# EasyEDA Pro project demo.eprj

# Schematic Schematic1
Create Date: 2024-03-22; Page Name: P1; Project Name: demo; Schematic Name: Schematic1; Update Date: 2024-03-23; Company: 嘉立创EDA; Page Size: A4; Version: V1.0
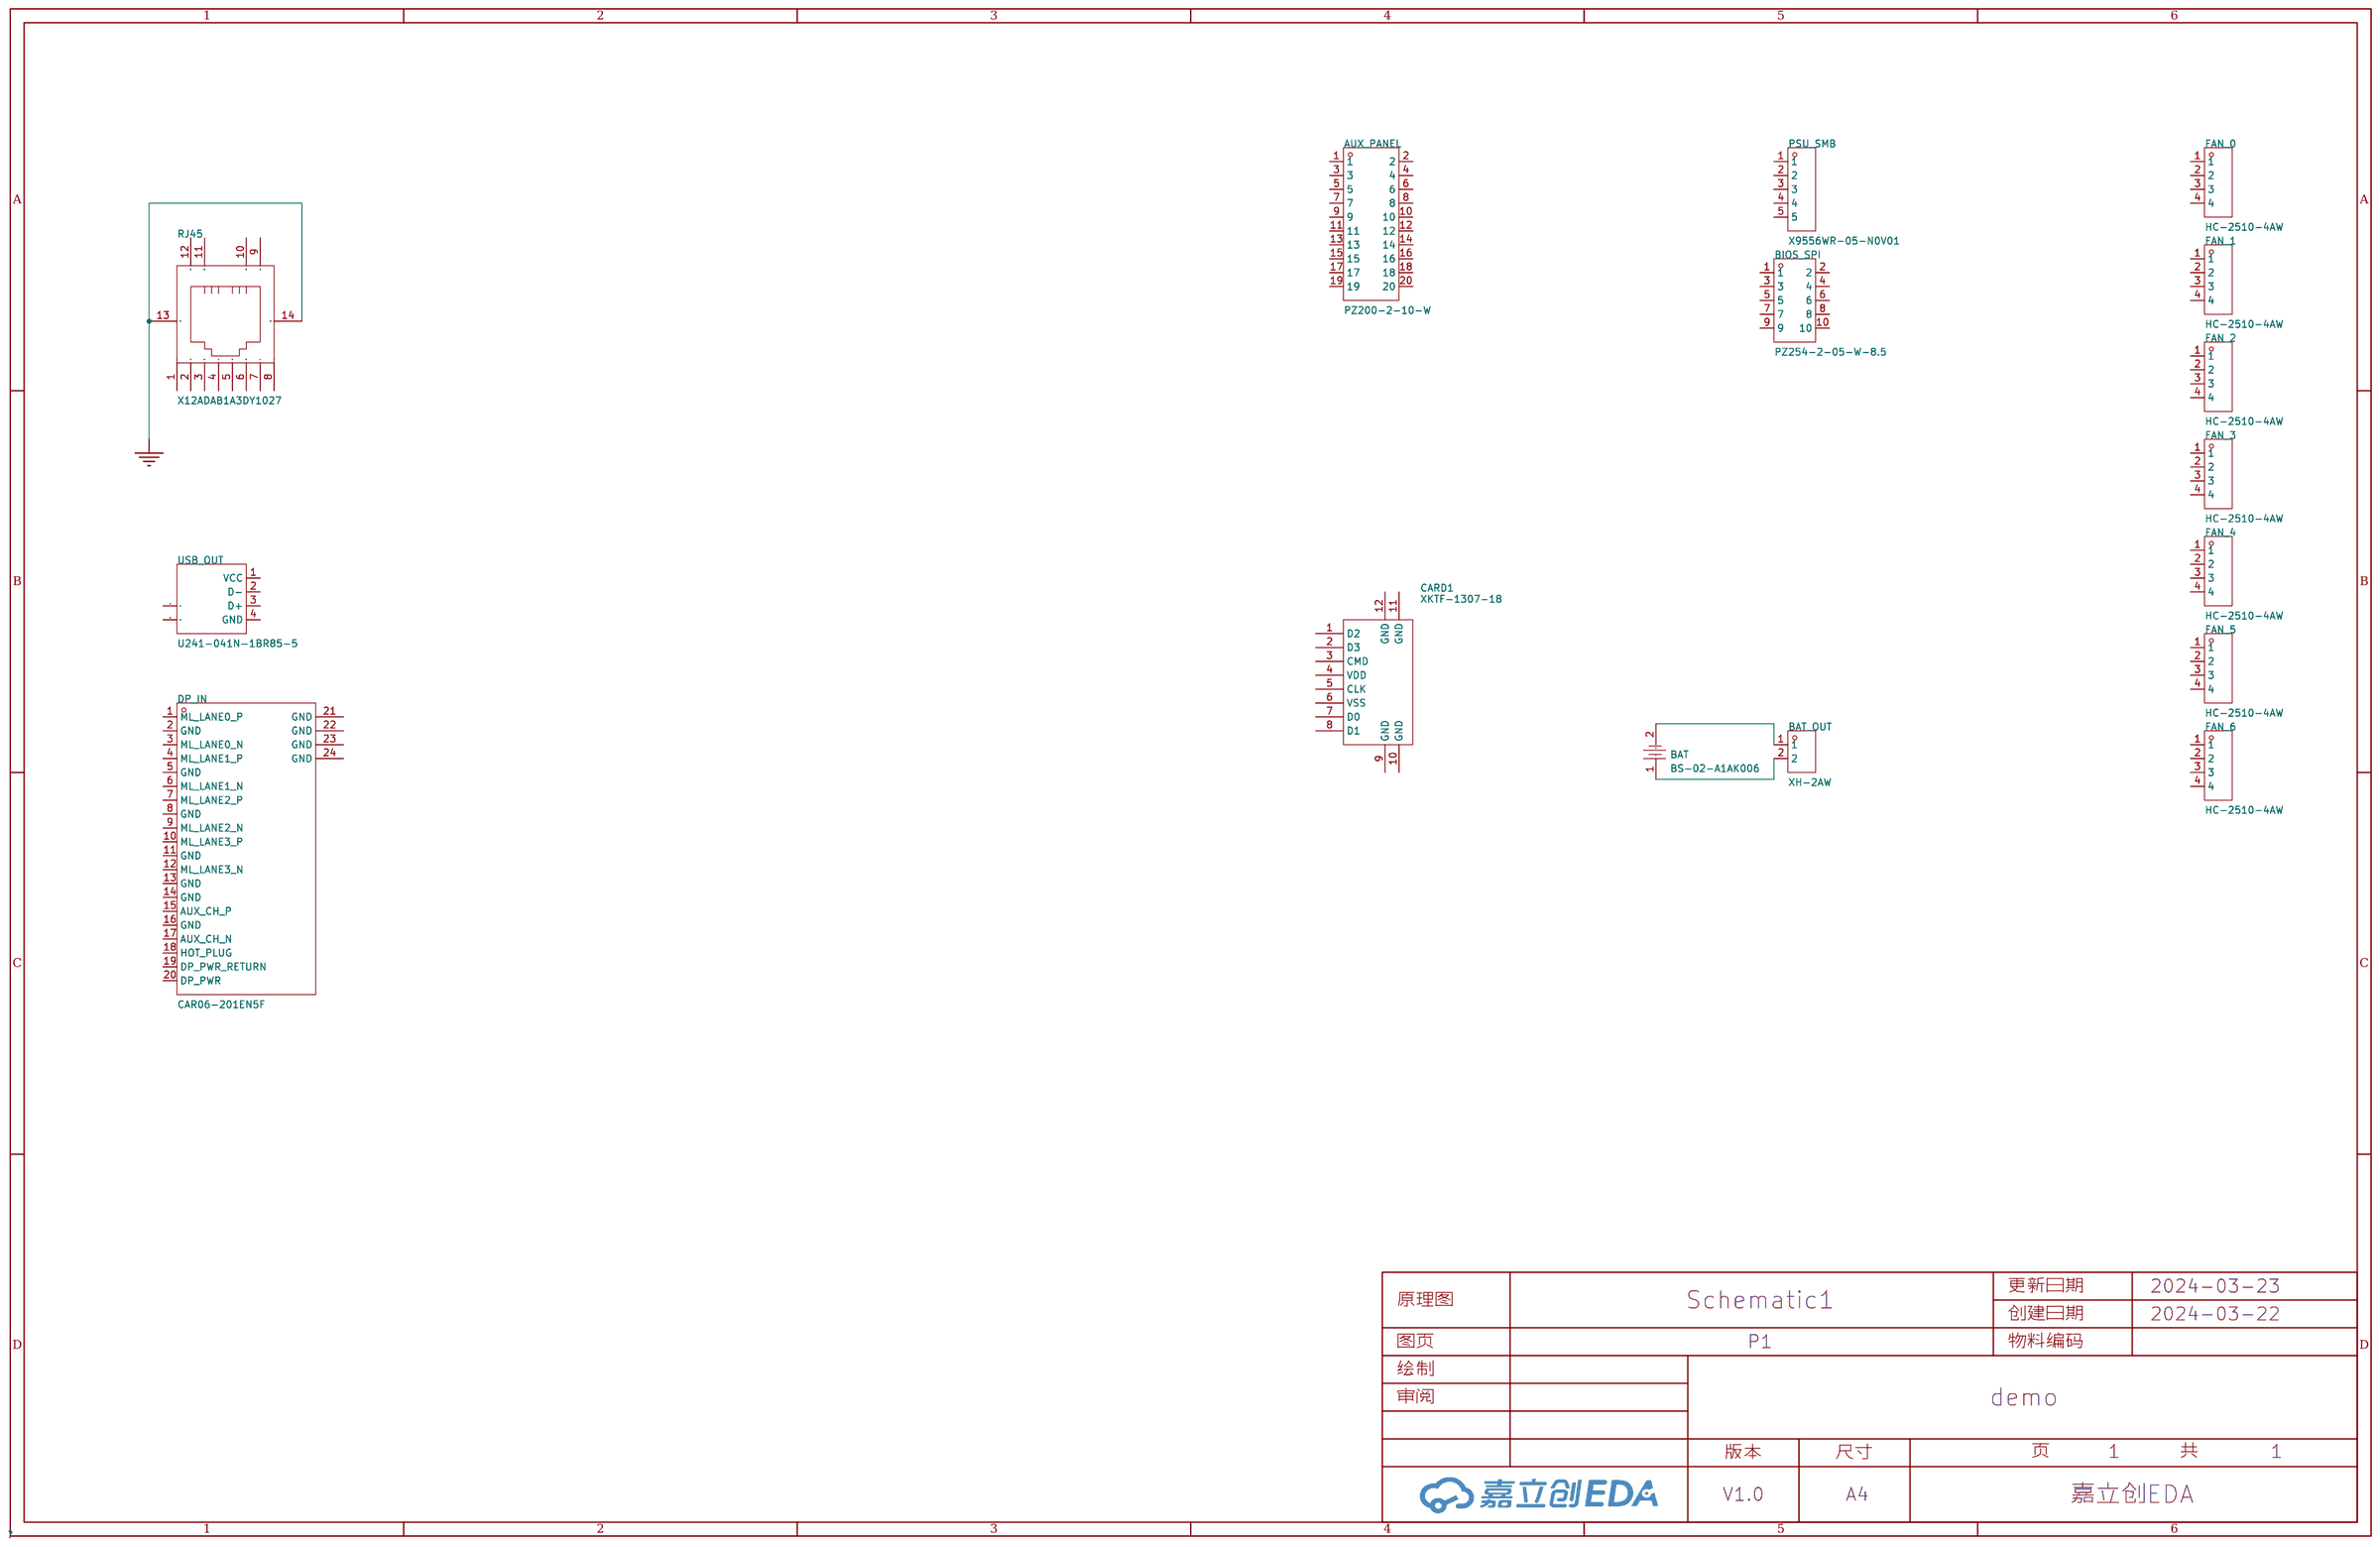
[diagram p0: schematic sheet]

## Parts
AUX_PANEL  PZ200-2-10-W  [HDR-TH_20P-P2.00-H-M-R2-C10-S2.00-W9.4]
BAT  BS-02-A1AK006  [BAT-TH_BS-02-A1AK006]
BAT_OUT  XH-2AW  [CONN-TH_XH-2AW_C2908611]
BIOS_SPI  PZ254-2-05-W-8.5  [HDR-TH_10P-P2.54-H-M-R2-C5-S2.54-N]
CARD1  XKTF-1307-18  [TF-SMD_XKTF-1307-18]
DP_IN  CAR06-201EN5F  [DP-SMD_CAR06-201EN5F]
FAN_0  HC-2510-4AW  [CONN-TH_4P-P2.54_HCTL_HC-2510-4AW]
FAN_1  HC-2510-4AW  [CONN-TH_4P-P2.54_HCTL_HC-2510-4AW]
FAN_2  HC-2510-4AW  [CONN-TH_4P-P2.54_HCTL_HC-2510-4AW]
FAN_3  HC-2510-4AW  [CONN-TH_4P-P2.54_HCTL_HC-2510-4AW]
FAN_4  HC-2510-4AW  [CONN-TH_4P-P2.54_HCTL_HC-2510-4AW]
FAN_5  HC-2510-4AW  [CONN-TH_4P-P2.54_HCTL_HC-2510-4AW]
FAN_6  HC-2510-4AW  [CONN-TH_4P-P2.54_HCTL_HC-2510-4AW]
PSU_SMB  X9556WR-05-N0V01  [CONN-TH_5P-P2.54_X9556WR-05-N0V01]
RJ45  X12ADAB1A3DY1027  [RJ45-TH_XKB_X12ADAB1A3DY1027]
USB_OUT  U241-041N-1BR85-5  [USB-B-TH_U241-041N-1BR85-1]

## Library data of the parts
AUX_PANEL = PZ200-2-10-W: 插针结构:2x10P;间距:2mm;行距:2mm;圆针/方针:方针;安装类型:弯插;排数:双排;总PIN位数:20P;额定电流:1.5A;额定电压:-;配合针长度:4mm;塑高:2mm;端接针长度:-;触头材质:黄铜;工作温度范围:-40℃~+105℃;焊接温度(最大值):260℃@5S;颜色:黑色;; LCSC Part Name: 2x10P 间距:2mm 方针 弯插; Supplier Part: C2906016; Manufacturer: HCTL(华灿天禄); Supplier Footprint: 弯插,P=2mm; JLCPCB Part Class: 扩展库; Datasheet: https://atta.szlcsc.com/upload/public/pdf/source/20230609/C576DAC8165D5B0B9EF6C372F4465F85.pdf; Supplier: LCSC; Pin Structure: 2x10P; Pitch: 2mm; Row Spacing: 2mm; Circluar Pins/Square Pins: 方针; Mounting Type: 弯插; Number of Rows: 双排; Number of Pins: 20P; Current Rating (Max): 1.5A; Length of Mating Pin: 4mm; Insulation Height: 2mm; Contact Material: 黄铜; Operating Temperature Range: -40℃~+105℃; Soldering Temperature(Max): 260℃@5S; Color: 黑色
BAT = BS-02-A1AK006: 连接器类型:电池底座;适用电池规格:CR2032;触点电镀:锡;工作温度范围:-25℃~+85℃;; LCSC Part Name: 电池底座 适用电池:CR2032; Supplier Part: C964746; Manufacturer: MYOUNG(美阳); Supplier Footprint: 插件; JLCPCB Part Class: 扩展库; Datasheet: https://atta.szlcsc.com/upload/public/pdf/source/20201218/C964746_D636BD2F273EEE7B636B6EF7E90F8FC5.pdf; Supplier: LCSC; Connector Type: 电池底座; Battery Type: CR2032; Contact Plating: 锡; Operating Temperature Range: -25℃~+85℃
BAT_OUT = XH-2AW_C2908611: 插针结构:1x2P;间距:2.54mm;安装方式:弯插;参考系列:XH;总PIN数:2P;排数:1;每排PIN数:2;行距:-;额定电流:3A;触头材质:黄铜;触头镀层:锡;工作温度范围:-25℃~+85℃;; LCSC Part Name: 1x2P 间距:2.54mm 弯插 系列:XH; Supplier Part: C2908611; Manufacturer: HCTL(华灿天禄); Supplier Footprint: 弯插,P=2.54mm; JLCPCB Part Class: 扩展库; Datasheet: https://atta.szlcsc.com/upload/public/pdf/source/20230711/B565BAF3B11666EF6B81B3605408F2BD.pdf; Supplier: LCSC; Pins Structure: 1x2P; Pitch: 2.54mm; Mounting Style: 弯插; Reference Series: XH; Number of Pins: 2P; Number of Rows: 1; Number of PINs Per Row: 2; Current Rating (Max): 3A; Contact Material: 黄铜; Contact Plating: 锡; Operating Temperature Range: -25℃~+85℃
BIOS_SPI = PZ254-2-05-W-8.5: 插针结构:2x5P;间距:2.54mm;行距:2.54mm;圆针/方针:方针;安装类型:弯插;排数:双排;总PIN位数:10P;额定电流:3A;额定电压:-;配合针长度:6mm;塑高:2.5mm;端接针长度:-;触头材质:-;工作温度范围:-40℃~+105℃;焊接温度(最大值):260℃@10S;颜色:黑色;; LCSC Part Name: 2x5P 间距:2.54mm 方针 弯插; Supplier Part: C2894985; Manufacturer: HCTL(华灿天禄); Supplier Footprint: 弯插,P=2.54mm; JLCPCB Part Class: 扩展库; Datasheet: https://atta.szlcsc.com/upload/public/pdf/source/20230609/1B60364E488FD8696AA7206A46578DEA.pdf; Supplier: LCSC; Pin Structure: 2x5P; Pitch: 2.54mm; Row Spacing: 2.54mm; Circluar Pins/Square Pins: 方针; Mounting Type: 弯插; Number of Rows: 双排; Number of Pins: 10P; Current Rating (Max): 3A; Length of Mating Pin: 6mm; Insulation Height: 2.5mm; Operating Temperature Range: -40℃~+105℃; Soldering Temperature(Max): 260℃@10S; Color: 黑色
CARD1 = XKTF-1307-18: 卡连接方式:翻盖式;卡类型:MicroSD卡(TF卡);连接器类型:卡座;本体最大高度:1.8mm;触头材质:铜合金;触头镀层:金;工作温度范围:-25℃~+80℃;焊接温度(最大值):260℃;; LCSC Part Name: 翻盖式 MicroSD卡(TF卡) 卡座; Supplier Part: C883270; Manufacturer: XKB Connectivity(中国星坤); Supplier Footprint: SMD; JLCPCB Part Class: 扩展库; Datasheet: https://atta.szlcsc.com/upload/public/pdf/source/20201016/C883270_E734F097901BAAAB6B007AA2692E6303.pdf; Supplier: LCSC; Card Connection Mode: 翻盖式; Card Type: MicroSD卡(TF卡); Connector Type: 卡座; Maximum Body Height: 1.8mm; Contact Material: 铜合金; Contact Plating: 金; Operating Temperature Range: -25℃~+80℃; Soldering Temperature(Max): 260℃
DP_IN = CAR06-201EN5F: 连接器类型:DisplayPort;公母:母;总PIN位数:20P;安装方式:卧贴;排数:1;额定电流:500mA;工作温度范围:-25℃~+85℃;; LCSC Part Name: DisplayPort 母 P数:20P; Supplier Part: C908454; Manufacturer: XKB Connectivity(中国星坤); Supplier Footprint: SMD; JLCPCB Part Class: 扩展库; Datasheet: https://atta.szlcsc.com/upload/public/pdf/source/20211011/51ABB24801A8C5EF87749AD132E70003.pdf; Supplier: LCSC; Connector Type: DisplayPort; Gender: 母; Number of Pins: 20P; Mounting Style: 卧贴; Number of Rows: 1; Current Rating (Max): 500mA; Operating Temperature Range: -25℃~+85℃
FAN_0-FAN_6 = HC-2510-4AW: 插针结构:1x4P;间距:2.54mm;安装方式:弯插;参考系列:-;总PIN数:4P;排数:1;每排PIN数:4;行距:-;额定电流:4A;触头材质:黄铜;触头镀层:锡;工作温度范围:-25℃~+85℃;; LCSC Part Name: 1x4P 间距:2.54mm 弯插; Supplier Part: C2982043; Manufacturer: HCTL(华灿天禄); Supplier Footprint: 弯插,P=2.54mm; JLCPCB Part Class: 扩展库; Datasheet: https://atta.szlcsc.com/upload/public/pdf/source/20220311/83CB9A6B67C6DEDDA2AF08A1DCFC516E.pdf; Supplier: LCSC; Pins Structure: 1x4P; Pitch: 2.54mm; Mounting Style: 弯插; Number of Pins: 4P; Number of Rows: 1; Number of PINs Per Row: 4; Current Rating (Max): 4A; Contact Material: 黄铜; Contact Plating: 锡; Operating Temperature Range: -25℃~+85℃
PSU_SMB = X9556WR-05-N0V01: 插针结构:1x5P;间距:2.54mm;安装方式:弯插;参考系列:-;总PIN数:5P;排数:1;每排PIN数:5;行距:-;额定电流:3A;触头材质:黄铜;触头镀层:金;工作温度范围:-25℃~+85℃;; LCSC Part Name: 1x5P 间距:2.54mm 弯插 黑色; Supplier Part: C397413; Manufacturer: XKB Connectivity(中国星坤); Supplier Footprint: 弯插,P=2.54mm; JLCPCB Part Class: 扩展库; Datasheet: https://atta.szlcsc.com/upload/public/pdf/source/20211009/A151F4A7D48590158897B3E84FF3483D.pdf; Supplier: LCSC; Pins Structure: 1x5P; Pitch: 2.54mm; Mounting Style: 弯插; Number of Pins: 5P; Number of Rows: 1; Number of PINs Per Row: 5; Current Rating (Max): 3A; Contact Material: 黄铜; Contact Plating: 金; Operating Temperature Range: -25℃~+85℃
RJ45 = X12ADAB1A3DY1027: 连接器类型:RJ插座;USOC代码:RJ45;端口数量:1;安装方式:弯插;屏蔽:有屏蔽;LED:带LED;触头材质:磷青铜;触头镀层:金;工作温度范围:-40℃~+85℃;焊接温度(最大值):260℃;; LCSC Part Name: RJ45 弯插 带LED; Supplier Part: C2916459; Manufacturer: XKB Connectivity(中国星坤); Supplier Footprint: 插件; JLCPCB Part Class: Extended Part; Datasheet: https://atta.szlcsc.com/upload/public/pdf/source/20211125/C87FAD289025EF9CBAF2F9931DE12964.pdf; Supplier: LCSC; Connector Type: RJ插座; Number of Ports: 1; Mounting Style: 弯插; Shielding: 有屏蔽; LED: 带LED; Contact Material: 磷青铜; Contact Plating: 金; Operating Temperature Range: -40℃~+85℃; Soldering Temperature(Max): 260℃
USB_OUT = U241-041N-1BR85-5: 连接器类型:Type-B;标准:USB 2.0;公母:母;端口数量:1;触点数量:4P;安装方式:弯插;额定电流 - 电源:1.5A;触头材质:黄铜;触头镀层:金;工作温度范围:-40℃~+85℃;焊接温度(最大值):235℃;; LCSC Part Name: Type-B 母 弯插; Supplier Part: C2880606; Manufacturer: XKB Connectivity(中国星坤); Supplier Footprint: 插件; JLCPCB Part Class: 扩展库; Datasheet: https://atta.szlcsc.com/upload/public/pdf/source/20211011/96CE344EA33EF85845E438A5758B100B.pdf; Supplier: LCSC; Connector Type: Type-B; Standard: USB 2.0; Gender: 母; Number of Ports: 1; Number of Contacts: 4P; Mounting Style: 弯插; Current Rating - Power (Max): 1.5A; Contact Material: 黄铜; Contact Plating: 金; Operating Temperature Range: -40℃~+85℃; Soldering Temperature(Max): 235℃

## Nets
GND: RJ45.13(GND) RJ45.14(GND)
$1N3938: BAT.2 BAT_OUT.1
$1N3942: BAT.1 BAT_OUT.2

Not connected (* = marked no-connect by the designer): AUX_PANEL 1 2 3 4 5 6 7 8 9 10 11 12 13 14 15 16 17 18 19 20; BIOS_SPI 1 2 3 4 5 6 7 8 9 10; CARD1 1(D2) 2(D3) 3(CMD) 4(VDD) 5(CLK) 6(VSS) 7(D0) 8(D1) 9(GND) 10(GND) 11(GND) 12(GND); DP_IN 1(ML_LANE0_P) 2(GND) 3(ML_LANE0_N) 4(ML_LANE1_P) 5(GND) 6(ML_LANE1_N) 7(ML_LANE2_P) 8(GND) 9(ML_LANE2_N) 10(ML_LANE3_P) 11(GND) 12(ML_LANE3_N) 13(GND) 14(GND) 15(AUX_CH_P) 16(GND) 17(AUX_CH_N) 18(HOT_PLUG) 19(DP_PWR_RETURN) 20(DP_PWR) 21(GND) 22(GND) 23(GND) 24(GND); FAN_0 1 2 3 4; FAN_1 1 2 3 4; FAN_2 1 2 3 4; FAN_3 1 2 3 4; FAN_4 1 2 3 4; FAN_5 1 2 3 4; FAN_6 1 2 3 4; PSU_SMB 1 2 3 4 5; RJ45 1 2 3 4 5 6 7 8 9(LEDG-) 10(LEDG+) 11(LEDY-) 12(LEDY+); USB_OUT 1(VCC) 2(D-) 3(D+) 4(GND) 5 6

# Board PCB1
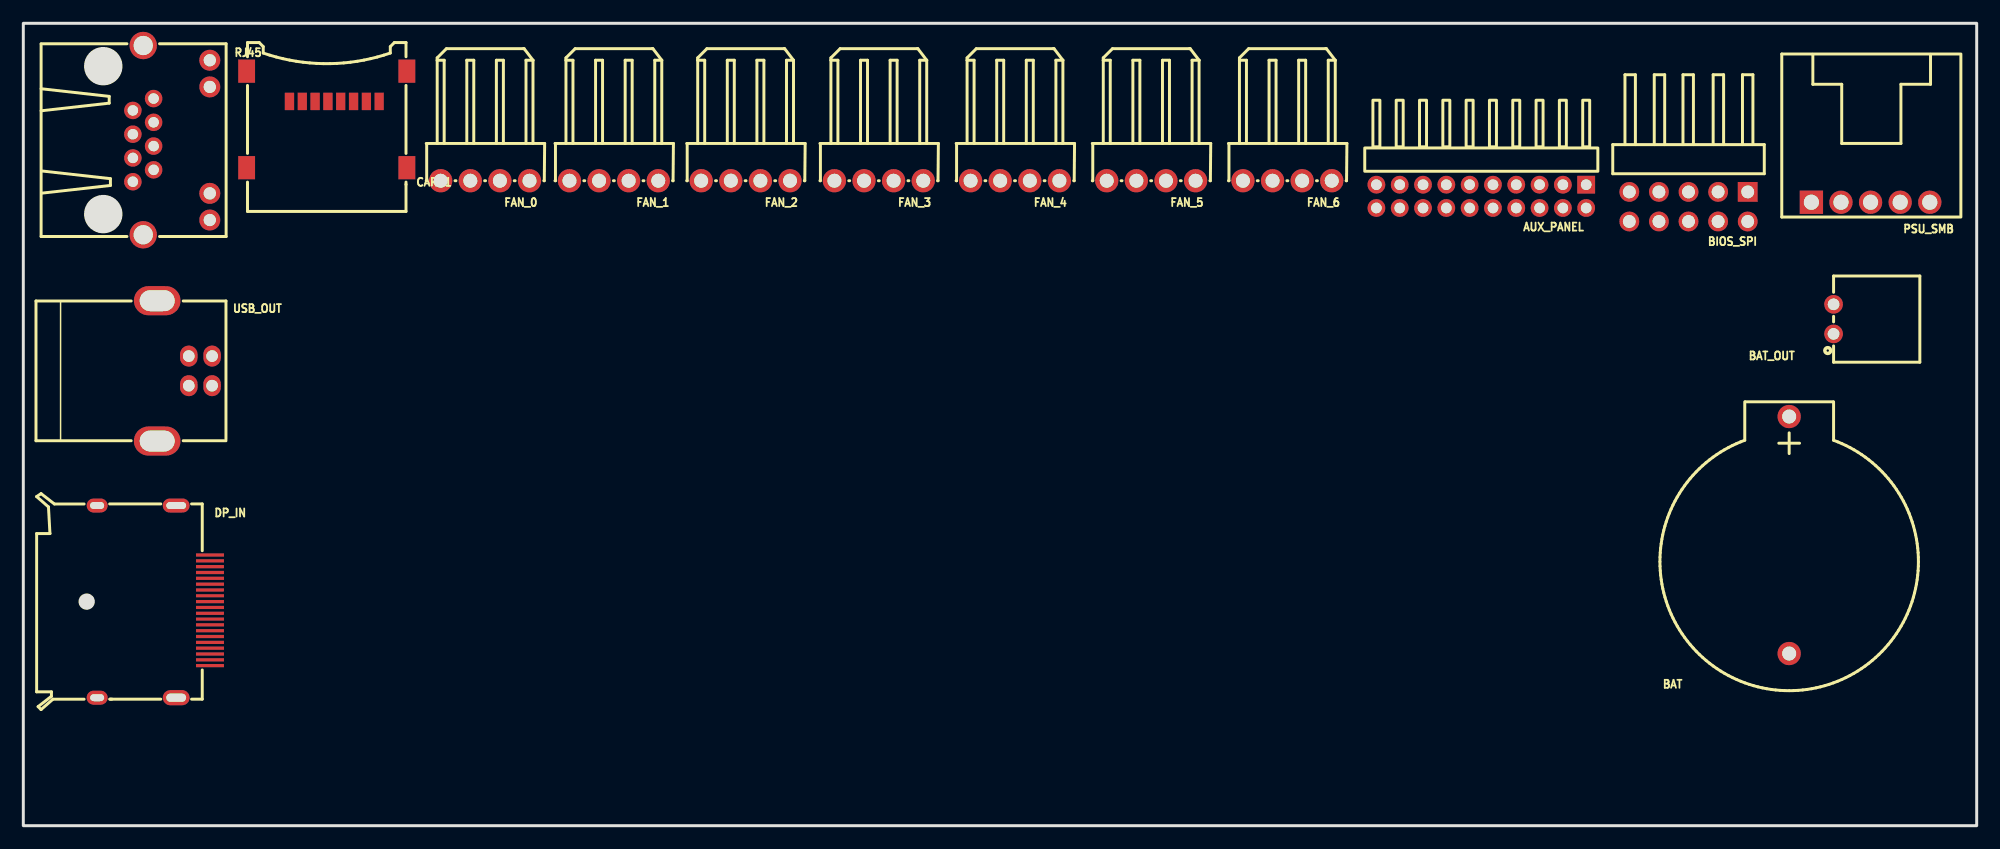
[diagram p1: board, top side]
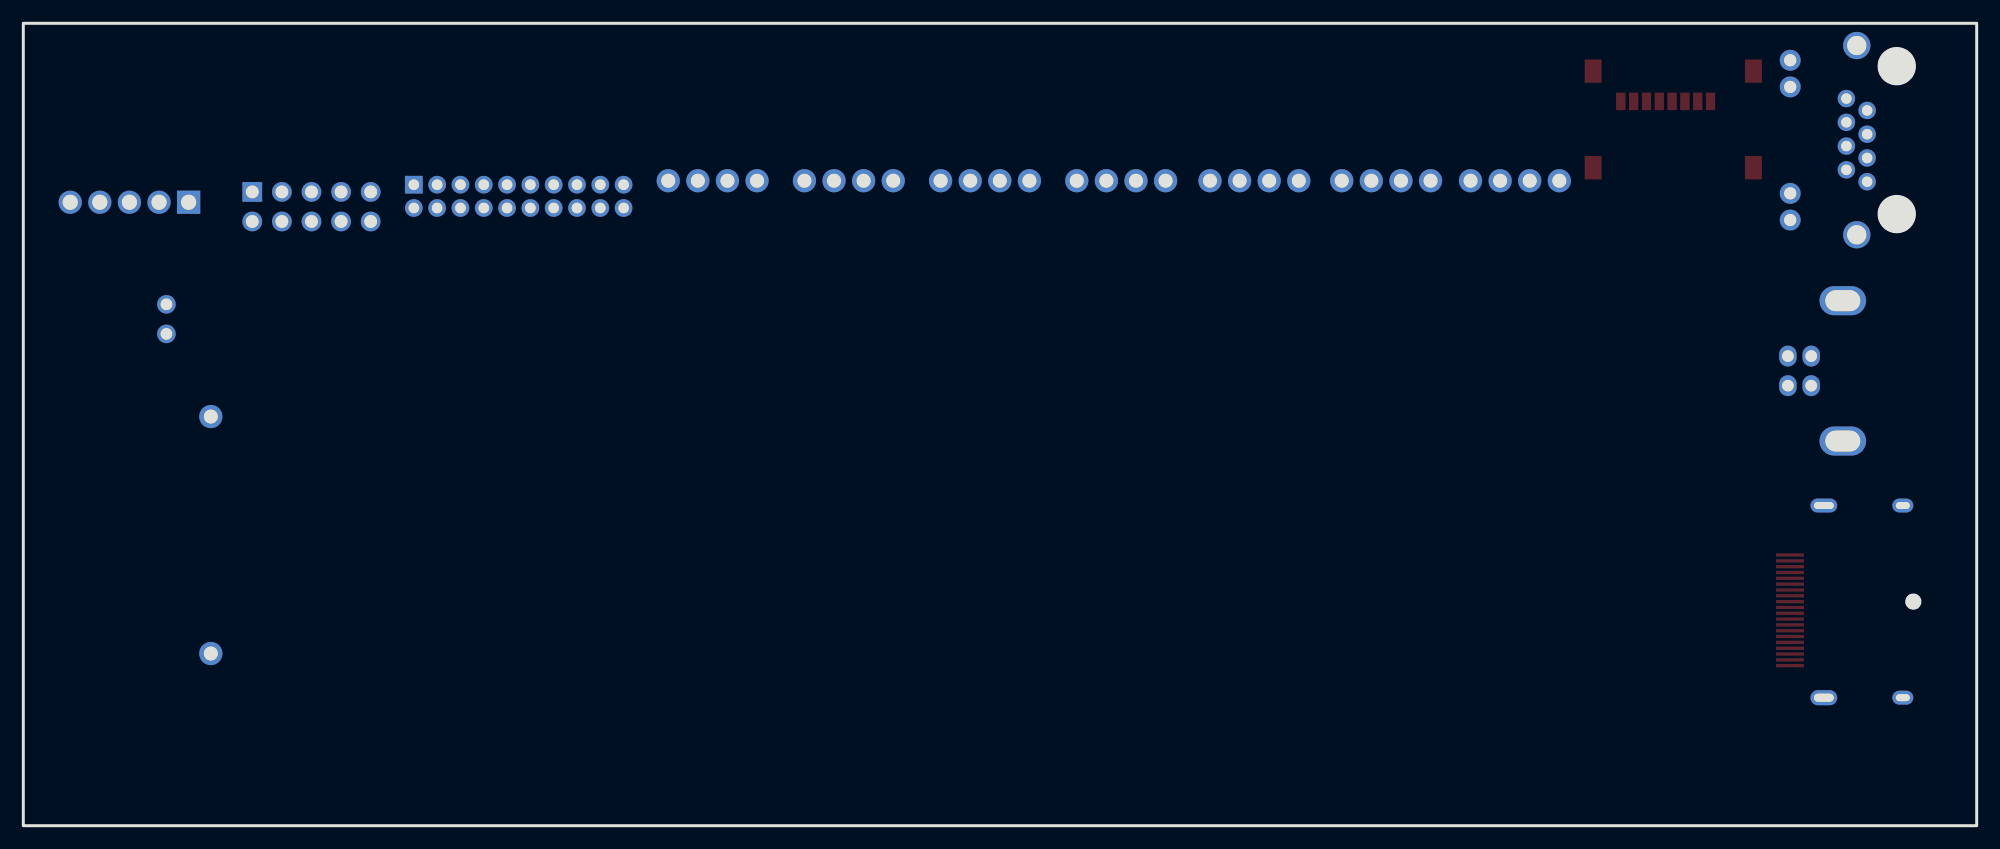
[diagram p2: board, bottom side, seen from below]

Outline 167.6 x 68.9 mm; copper layers: Top Layer, Bottom Layer. Coordinates in mm from the lower left corner of the outline.
Outline path: rectangle 0,68.9 167.6,0
Stack: Top Layer 0.035mm / Dielectric1 1.51mm FR4 er 4.5 / Bottom Layer 0.035mm

## Design rules (mm)
template: JLCPCB Capability(Two Layers Board)
spacing copperThickness1oz (default): track to track 0.102, other pairs 0.152 to 0.3
spacing copperThickness2oz: track to track 0.203, other pairs 0.152 to 0.3
track width copperThickness1oz (default): min 0.127, default 0.254, max 2.54
track width copperThickness2oz: min 0.203, default 0.254, max 2.54
differential pair differentialPair (default): width min 0.127, default 0.254, max 2.54; gap min 0.152, default 0.152
via viaSize (default): diameter min 0.5, default 0.61, max 10; hole min 0.3, default 0.305, max 6.3

## Placement (name value [footprint] x y rotation side)
AUX_PANEL  PZ200-2-10-W  [HDR-TH_20P-P2.00-H-M-R2-C10-S2.00-W9.4]  125.1 54.04 180 top
BAT  BS-02-A1AK006  [BAT-TH_BS-02-A1AK006]  151.51 24.96 90 top
BAT_OUT  XH-2AW  [CONN-TH_XH-2AW_C2908611]  155.32 43.5 90 top
BIOS_SPI  PZ254-2-05-W-8.5  [HDR-TH_10P-P2.54-H-M-R2-C5-S2.54-N]  142.88 53.15 180 top
CARD1  XKTF-1307-18  [TF-SMD_XKTF-1307-18]  26.04 60.64 180 top
DP_IN  CAR06-201EN5F  [DP-SMD_CAR06-201EN5F]  11.18 19.24 270 top
FAN_0  HC-2510-4AW  [CONN-TH_4P-P2.54_HCTL_HC-2510-4AW]  39.62 55.38 180 top
FAN_1  HC-2510-4AW  [CONN-TH_4P-P2.54_HCTL_HC-2510-4AW]  50.67 55.38 180 top
FAN_2  HC-2510-4AW  [CONN-TH_4P-P2.54_HCTL_HC-2510-4AW]  61.97 55.38 180 top
FAN_3  HC-2510-4AW  [CONN-TH_4P-P2.54_HCTL_HC-2510-4AW]  73.4 55.38 180 top
FAN_4  HC-2510-4AW  [CONN-TH_4P-P2.54_HCTL_HC-2510-4AW]  85.09 55.38 180 top
FAN_5  HC-2510-4AW  [CONN-TH_4P-P2.54_HCTL_HC-2510-4AW]  96.77 55.38 180 top
FAN_6  HC-2510-4AW  [CONN-TH_4P-P2.54_HCTL_HC-2510-4AW]  108.45 55.38 180 top
PSU_SMB  X9556WR-05-N0V01  [CONN-TH_5P-P2.54_X9556WR-05-N0V01]  158.5 53.53 180 top
RJ45  X12ADAB1A3DY1027  [RJ45-TH_XKB_X12ADAB1A3DY1027]  12.7 58.87 270 top
USB_OUT  U241-041N-1BR85-5  [USB-B-TH_U241-041N-1BR85-1]  13.84 39.05 270 top

## Footprints (pads in the part's own frame, mm; a bottom-side part is the same pattern mirrored in y, then rotated)
BAT-TH_BS-02-A1AK006
  round 2 hole 1.2: 1(10.175,0) 2(-10.175,0)
CONN-TH_4P-P2.54_HCTL_HC-2510-4AW
  round 2 hole 1.2: 1(-3.81,0) 2(-1.27,0) 3(1.27,0) 4(3.81,0)
CONN-TH_5P-P2.54_X9556WR-05-N0V01
  rect 2x2 hole 1.3: 1(5.08,0)
  round 2 hole 1.3: 2(2.54,0) 3(0,0) 4(-2.54,0) 5(-5.08,0)
CONN-TH_XH-2AW_C2908611
  round 1.6 hole 1: 1(-1.27,0) 2(1.27,0)
DP-SMD_CAR06-201EN5F
  rect 0.28x2.4 smd: 1(5.5,4.84) 2(5,4.84) 3(4.5,4.84) 4(4,4.84) 5(3.5,4.84) 6(3,4.84) 7(2.5,4.84) 8(2,4.84) 9(1.5,4.84) 10(1,4.84) 11(0.5,4.84) 12(0,4.84) 13(-0.5,4.84) 14(-1,4.84) 15(-1.5,4.84) 16(-2.001,4.84) 17(-2.5,4.84) 18(-3,4.84) 19(-3.5,4.84) 20(-4,4.84)
  oval 1.2x2.3 hole 0.6x1.7: 21(-8.25,1.94)
  oval 1.2x1.8 hole 0.6x1.2: 22(-8.25,-4.84) 23(8.25,-4.84)
  oval 1.3x2.3 hole 0.7x1.7: 24(8.25,1.94)
HDR-TH_10P-P2.54-H-M-R2-C5-S2.54-N
  rect 1.7x1.7 hole 1.1: 1(-5.08,-1.27)
  round 1.7 hole 1.1: 2(-5.08,1.27) 3(-2.54,-1.27) 4(-2.54,1.27) 5(0,-1.27) 6(0,1.27) 7(2.54,-1.27) 8(2.54,1.27) 9(5.08,-1.27) 10(5.08,1.27)
HDR-TH_20P-P2.00-H-M-R2-C10-S2.00-W9.4
  rect 1.524x1.524 hole 0.914: 1(-9,-1)
  round 1.524 hole 0.914: 2(-9,1) 3(-7,-1) 4(-7,1) 5(-5,-1) 6(-5,1) 7(-3,-1) 8(-3,1) 9(-1,-1) 10(-1,1) 11(1,-1) 12(1,1) 13(3,-1) 14(3,1) 15(5,-1) 16(5,1) 17(7,-1) 18(7,1) 19(9,-1) 20(9,1)
RJ45-TH_XKB_X12ADAB1A3DY1027
  round 1.5 hole 0.9: 1(3.57,-3.3) 2(2.55,-1.52) 3(1.53,-3.3) 4(0.51,-1.52) 5(-0.51,-3.3) 6(-1.53,-1.52) 7(-2.55,-3.3) 8(-3.57,-1.52)
  round 1.8 hole 1.05: 9(6.86,3.3) 10(4.57,3.3) 11(-4.57,3.3) 12(-6.86,3.3)
  round 2.35 hole 1.65: 13(8.125,-2.41) 14(-8.125,-2.41)
TF-SMD_XKTF-1307-18
  rect 0.8x1.5 smd: 1(3.2,-1.55) 2(2.1,-1.55) 3(1,-1.55) 4(-0.1,-1.55) 5(-1.2,-1.55) 6(-2.3,-1.55) 7(-3.4,-1.55) 8(-4.5,-1.55)
  rect 1.45x2 smd: 9(-6.875,4.15) 10(-6.875,-4.15) 11(6.875,-4.15) 12(6.875,4.15)
USB-B-TH_U241-041N-1BR85-1
  oval 1.8x1.5 hole 1: 1(1.27,2.355) 2(-1.27,2.355) 3(-1.27,0.355) 4(1.27,0.355)
  oval 2.5x4 hole 1.8x3: 5(6.025,-2.355) 6(-6.025,-2.355)

## Nets
As in the schematic.

Pads without a net: AUX_PANEL 1 2 3 4 5 6 7 8 9 10 11 12 13 14 15 16 17 18 19 20; BIOS_SPI 1 2 3 4 5 6 7 8 9 10; CARD1 1 2 3 4 5 6 7 8 9 10 11 12; DP_IN 1 2 3 4 5 6 7 8 9 10 11 12 13 14 15 16 17 18 19 20 21 22 23 24; FAN_0 1 2 3 4; FAN_1 1 2 3 4; FAN_2 1 2 3 4; FAN_3 1 2 3 4; FAN_4 1 2 3 4; FAN_5 1 2 3 4; FAN_6 1 2 3 4; PSU_SMB 1 2 3 4 5; RJ45 1 2 3 4 5 6 7 8 9 10 11 12; USB_OUT 1 2 3 4 5 6
